# Altium schematic sheet VS1003.SchDoc
size A4
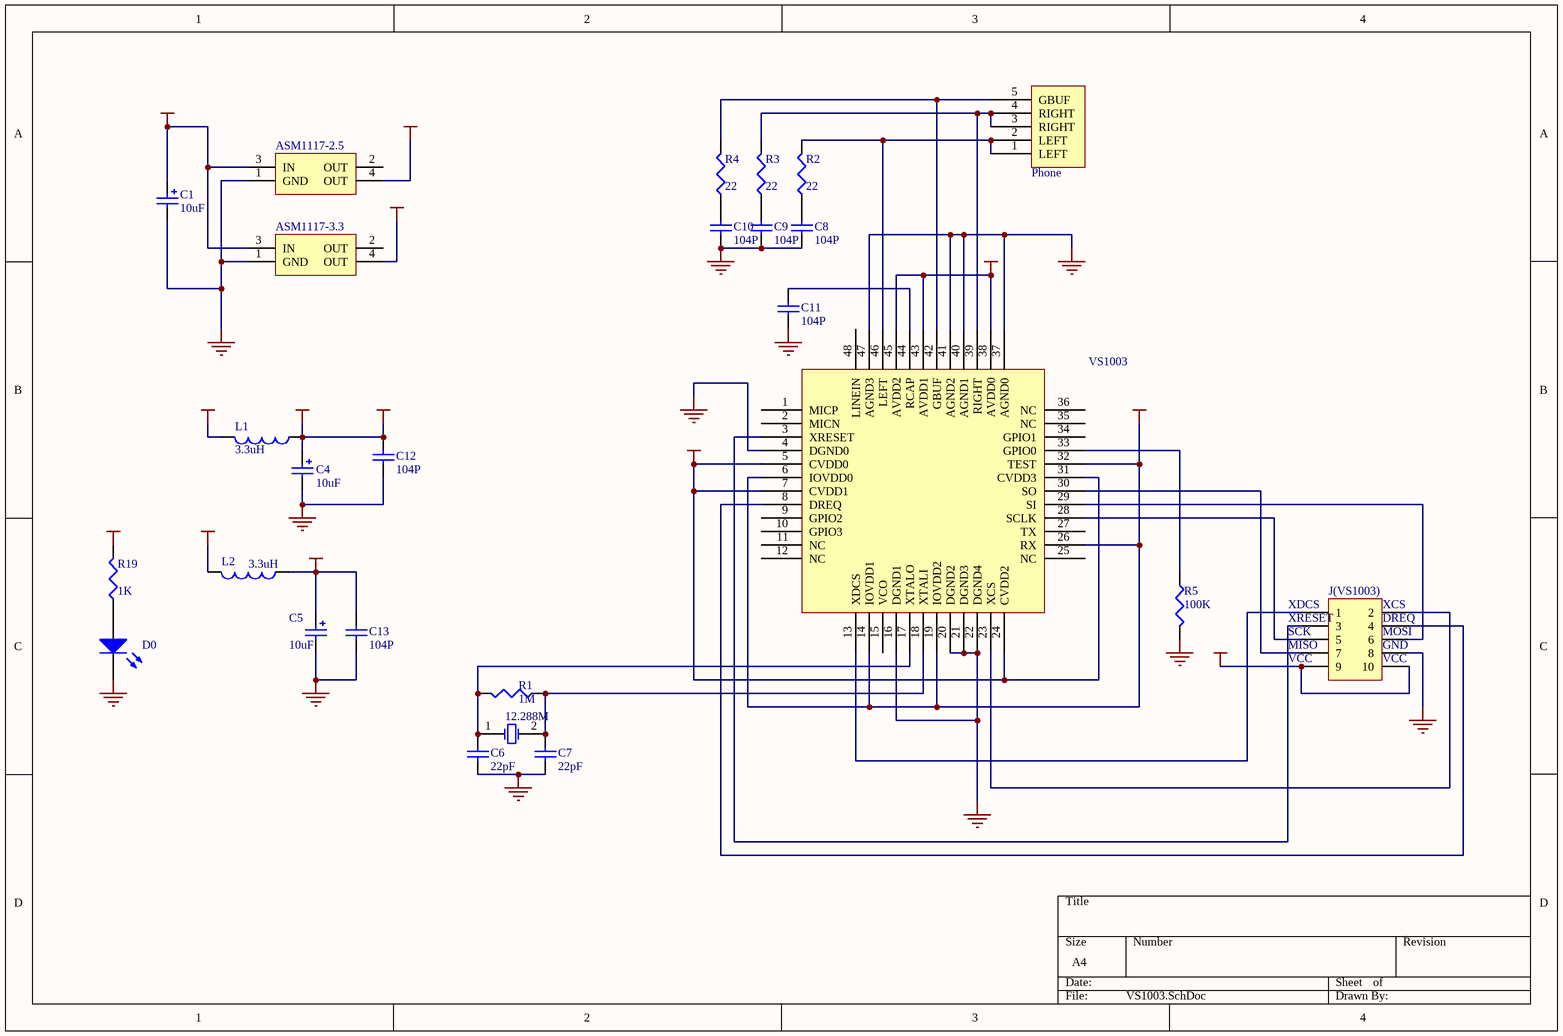
[diagram p0: VS1003.SchDoc]

## Parts
12.288M  XTAL  [RAD-0.2]  (value not drawn)
ASM1117-2.5  REG1117-5  [ZZ311]  (value not drawn)
ASM1117-3.3  REG1117-5  [ZZ311]  (value not drawn)
C1  value 10uF  [CR3225-1210]  (hidden comment: Cap Pol3)
C4  value 10uF  [CR3225-1210]  (hidden comment: Cap Pol3)
C5  value 10uF  [CR3225-1210]  (hidden comment: Cap Pol3)
C6  value 22pF  [CR2012-0805]  (hidden comment: Cap Semi)
C7  value 22pF  [CR2012-0805]  (hidden comment: Cap Semi)
C8  value 104P  [CR2012-0805]  (hidden comment: Cap Semi)
C9  value 104P  [CR2012-0805]  (hidden comment: Cap Semi)
C10  value 104P  [CR2012-0805]  (hidden comment: Cap Semi)
C11  value 104P  [CR2012-0805]  (hidden comment: Cap Semi)
C12  value 104P  [CR2012-0805]  (hidden comment: Cap Semi)
C13  value 104P  [CR2012-0805]  (hidden comment: Cap Semi)
D0  LED2  [R2012-0805]  (value not drawn)
J(VS1003)  Header 5X2  [HDR2X5]  (value not drawn)
L1  value 3.3uH  [R2012-0805]  (hidden comment: Inductor)
L2  value 3.3uH  [R2012-0805]  (hidden comment: Inductor)
Phone  Earphone  [Earphone]  (value not drawn)
R1  value 1M  [R2012-0805]  (hidden comment: Res3)
R2  value 22  [R2012-0805]  (hidden comment: Res3)
R3  value 22  [R2012-0805]  (hidden comment: Res3)
R4  value 22  [R2012-0805]  (hidden comment: Res3)
R5  value 100K  [R2012-0805]  (hidden comment: Res3)
R19  value 1K  [R2012-0805]  (hidden comment: Res3)
VS1003  VS1003B  [TQFP-48]  (value not drawn)

## Nets
2.5v: ASM1117-2.5.4(OUT) L2.2
3.3v: ASM1117-3.3.4(OUT) L1.2
AVDD: C4.1 C12.2 L1.1 VS1003.6(IOVDD0) VS1003.14(IOVDD1) VS1003.19(IOVDD2) VS1003.26(RX) VS1003.32(TEST) VS1003.38(AVDD0) VS1003.43(AVDD1) VS1003.45(AVDD2)  [also labelled IOVDD]
CVDD: C5.1 C13.2 L2.1 VS1003.5(CVDD0) VS1003.7(CVDD1) VS1003.24(CVDD2) VS1003.31(CVDD3)
GND: ASM1117-2.5.1(GND) ASM1117-3.3.1(GND) C1.2 C4.2 C5.2 C6.1 C7.2 C8.1 C9.1 C10.1 C11.1 C12.1 C13.1 D0.2(K) J(VS1003).8 R5.2 VS1003.4(DGND0) VS1003.16(DGND1) VS1003.20(DGND2) VS1003.21(DGND3) VS1003.22(DGND4) VS1003.37(AGND0) VS1003.40(AGND1) VS1003.41(AGND2) VS1003.47(AGND3)
VCC: ASM1117-2.5.3(IN) ASM1117-3.3.3(IN) C1.1 J(VS1003).9 J(VS1003).10 R19.2
Net12.288M_1: 12.288M.1(OSC1) C6.2 R1.2 VS1003.17(XTALO)
Net12.288M_2: 12.288M.2(OSC2) C7.1 R1.1 VS1003.18(XTALI)
NetC8_2: C8.2 R2.1
NetC9_2: C9.2 R3.1
NetC10_2: C10.2 R4.1
NetC11_2: C11.2 VS1003.44(RCAP)
NetD0_1: D0.1(A) R19.1
NetJ(VS1003)_1: J(VS1003).1 VS1003.13(XDCS)
NetJ(VS1003)_2: J(VS1003).2 VS1003.23(XCS)
NetJ(VS1003)_3: J(VS1003).3 VS1003.3(XRESET)
NetJ(VS1003)_4: J(VS1003).4 VS1003.8(DREQ)
NetJ(VS1003)_5: J(VS1003).5 VS1003.28(SCLK)
NetJ(VS1003)_6: J(VS1003).6 VS1003.29(SI)
NetJ(VS1003)_7: J(VS1003).7 VS1003.30(SO)
NetPhone_1: Phone.1(LEFT) Phone.2(LEFT) R2.2 VS1003.46(LEFT)
NetPhone_3: Phone.3(RIGHT) Phone.4(RIGHT) R3.2 VS1003.39(RIGHT)
NetPhone_5: Phone.5(GBUF) R4.2 VS1003.42(GBUF)
NetR5_1: R5.1 VS1003.33(GPIO0)

Not connected (* = marked no-connect by the designer): ASM1117-2.5 2(OUT); ASM1117-3.3 2(OUT); VS1003 1(MICP) 2(MICN) 9(GPIO2) 10(GPIO3) 11(NC) 12(NC) 15(VCO) 25(NC) 27(TX) 34(GPIO1) 35(NC) 36(NC) 48(LINEIN)

## Notes on the sheet
- (near J(VS1003)) XDCS
- (near J(VS1003)) SCK
- (near J(VS1003)) XRESET
- (near J(VS1003)) MISO
- (near J(VS1003)) XCS
- (near J(VS1003)) DREQ
- (near J(VS1003)) MOSI
- (near J(VS1003)) GND
- (near J(VS1003)) VCC

## Library data of the parts
12.288M = XTAL: Crystal Oscillator; Published: 8-Jun-2000; Revision: July-2002: Re-released for DXP Platform.; Publisher: Altium Limited
ASM1117-2.5 ASM1117-3.3 = REG1117-5: 800mA and 1A Low Dropout Positive Regulator 2.85V, 3.3V, 5V, and Adjustable; Package Information: Latest Revision: revC; Published: 8-Jun-2000; Revision: 17-Jul-2002: Re-released for DXP Platform.; Datasheet: Latest Revision: Sep-1997; Package Reference: ZZ311; Publisher: Altium Limited
C1 C4 C5 = Cap Pol3: Polarized Capacitor (Surface Mount); Published: 8-Jun-2000; Revision: July-2002: Re-released for DXP Platform.; Publisher: Altium Limited
C6-C13 = Cap Semi: Capacitor (Semiconductor SIM Model); Published: 8-Jun-2000; Revision: July-2002: Re-released for DXP Platform.; Publisher: Altium Limited
D0 = LED2: Typical RED, GREEN, YELLOW, AMBER GaAs LED; Published: 8-Jun-2000; Revision: July-2002: Re-released for DXP Platform.; Publisher: Altium Limited
J(VS1003) = Header 5X2: Header, 5-Pin, Dual row; Revision: 17-Jul-2002: Re-released for DXP Platform.; Publisher: Altium Limited
R1-R5 R19 = Res3: Resistor; Published: 8-Jun-2000; Revision: July-2002: Re-released for DXP Platform.; Publisher: Altium Limited
L1 L2 = Inductor: Published: 8-Jun-2000; Revision: July-2002: Re-released for DXP Platform.; Publisher: Altium Limited